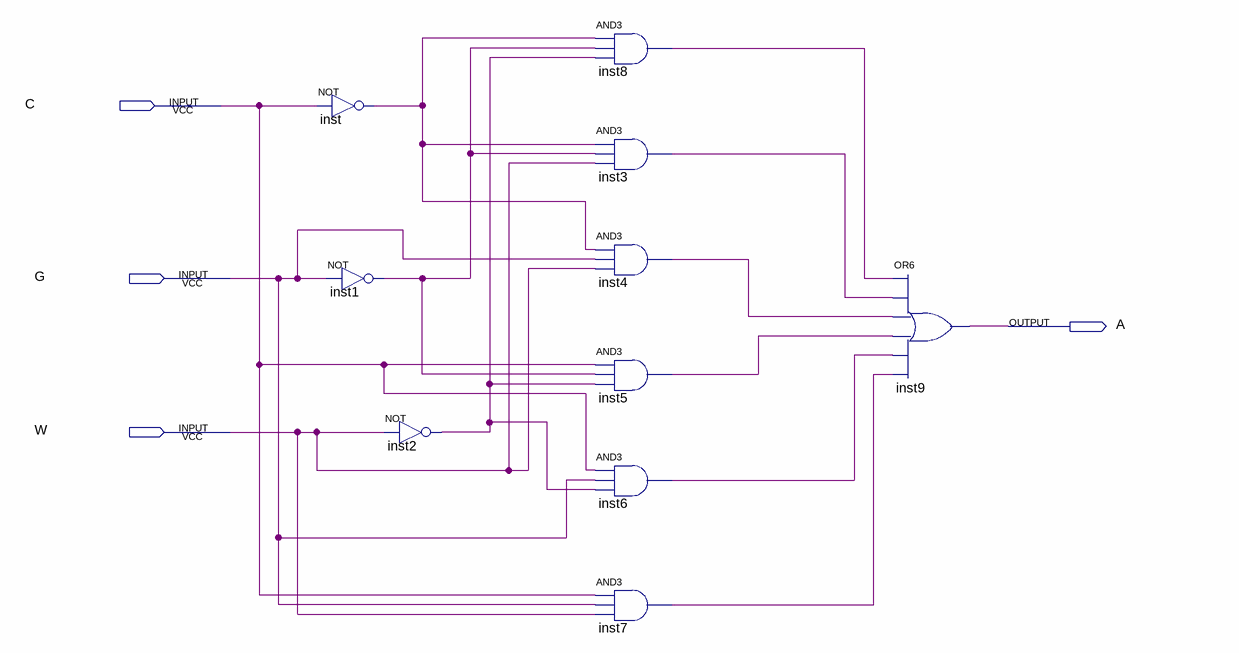
[diagram p0: schematic sheet]
// Quartus schematic lab2step2.bdf as structural Verilog: 10 symbols, 4 pins
module lab2step2 (
  input  C,
  input  G,
  input  W,
  output A
);

  wire inst1_out, inst2_out, inst3_out, inst4_out, inst5_out, inst6_out, inst7_out, inst8_out, inst_out;

  not inst (inst_out, C);
  not inst1 (inst1_out, G);
  not inst2 (inst2_out, W);
  and inst8 (inst8_out, inst_out, inst1_out, inst2_out);
  and inst3 (inst3_out, inst_out, inst1_out, W);
  and inst4 (inst4_out, inst_out, G, W);
  and inst5 (inst5_out, C, inst1_out, inst2_out);
  and inst6 (inst6_out, C, G, inst2_out);
  and inst7 (inst7_out, C, G, W);
  or inst9 (A, inst8_out, inst3_out, inst4_out, inst5_out, inst6_out, inst7_out);
endmodule
